# EasyEDA schematic Buttons-Sch-EasyEDA.json
TITLE: WatchLink Buttons Sensor; REV: 1.3; Date: 2024-01-16; Sheet: 1/1; Drawn By: Anandghan W; Company: UW Ubicomp Lab
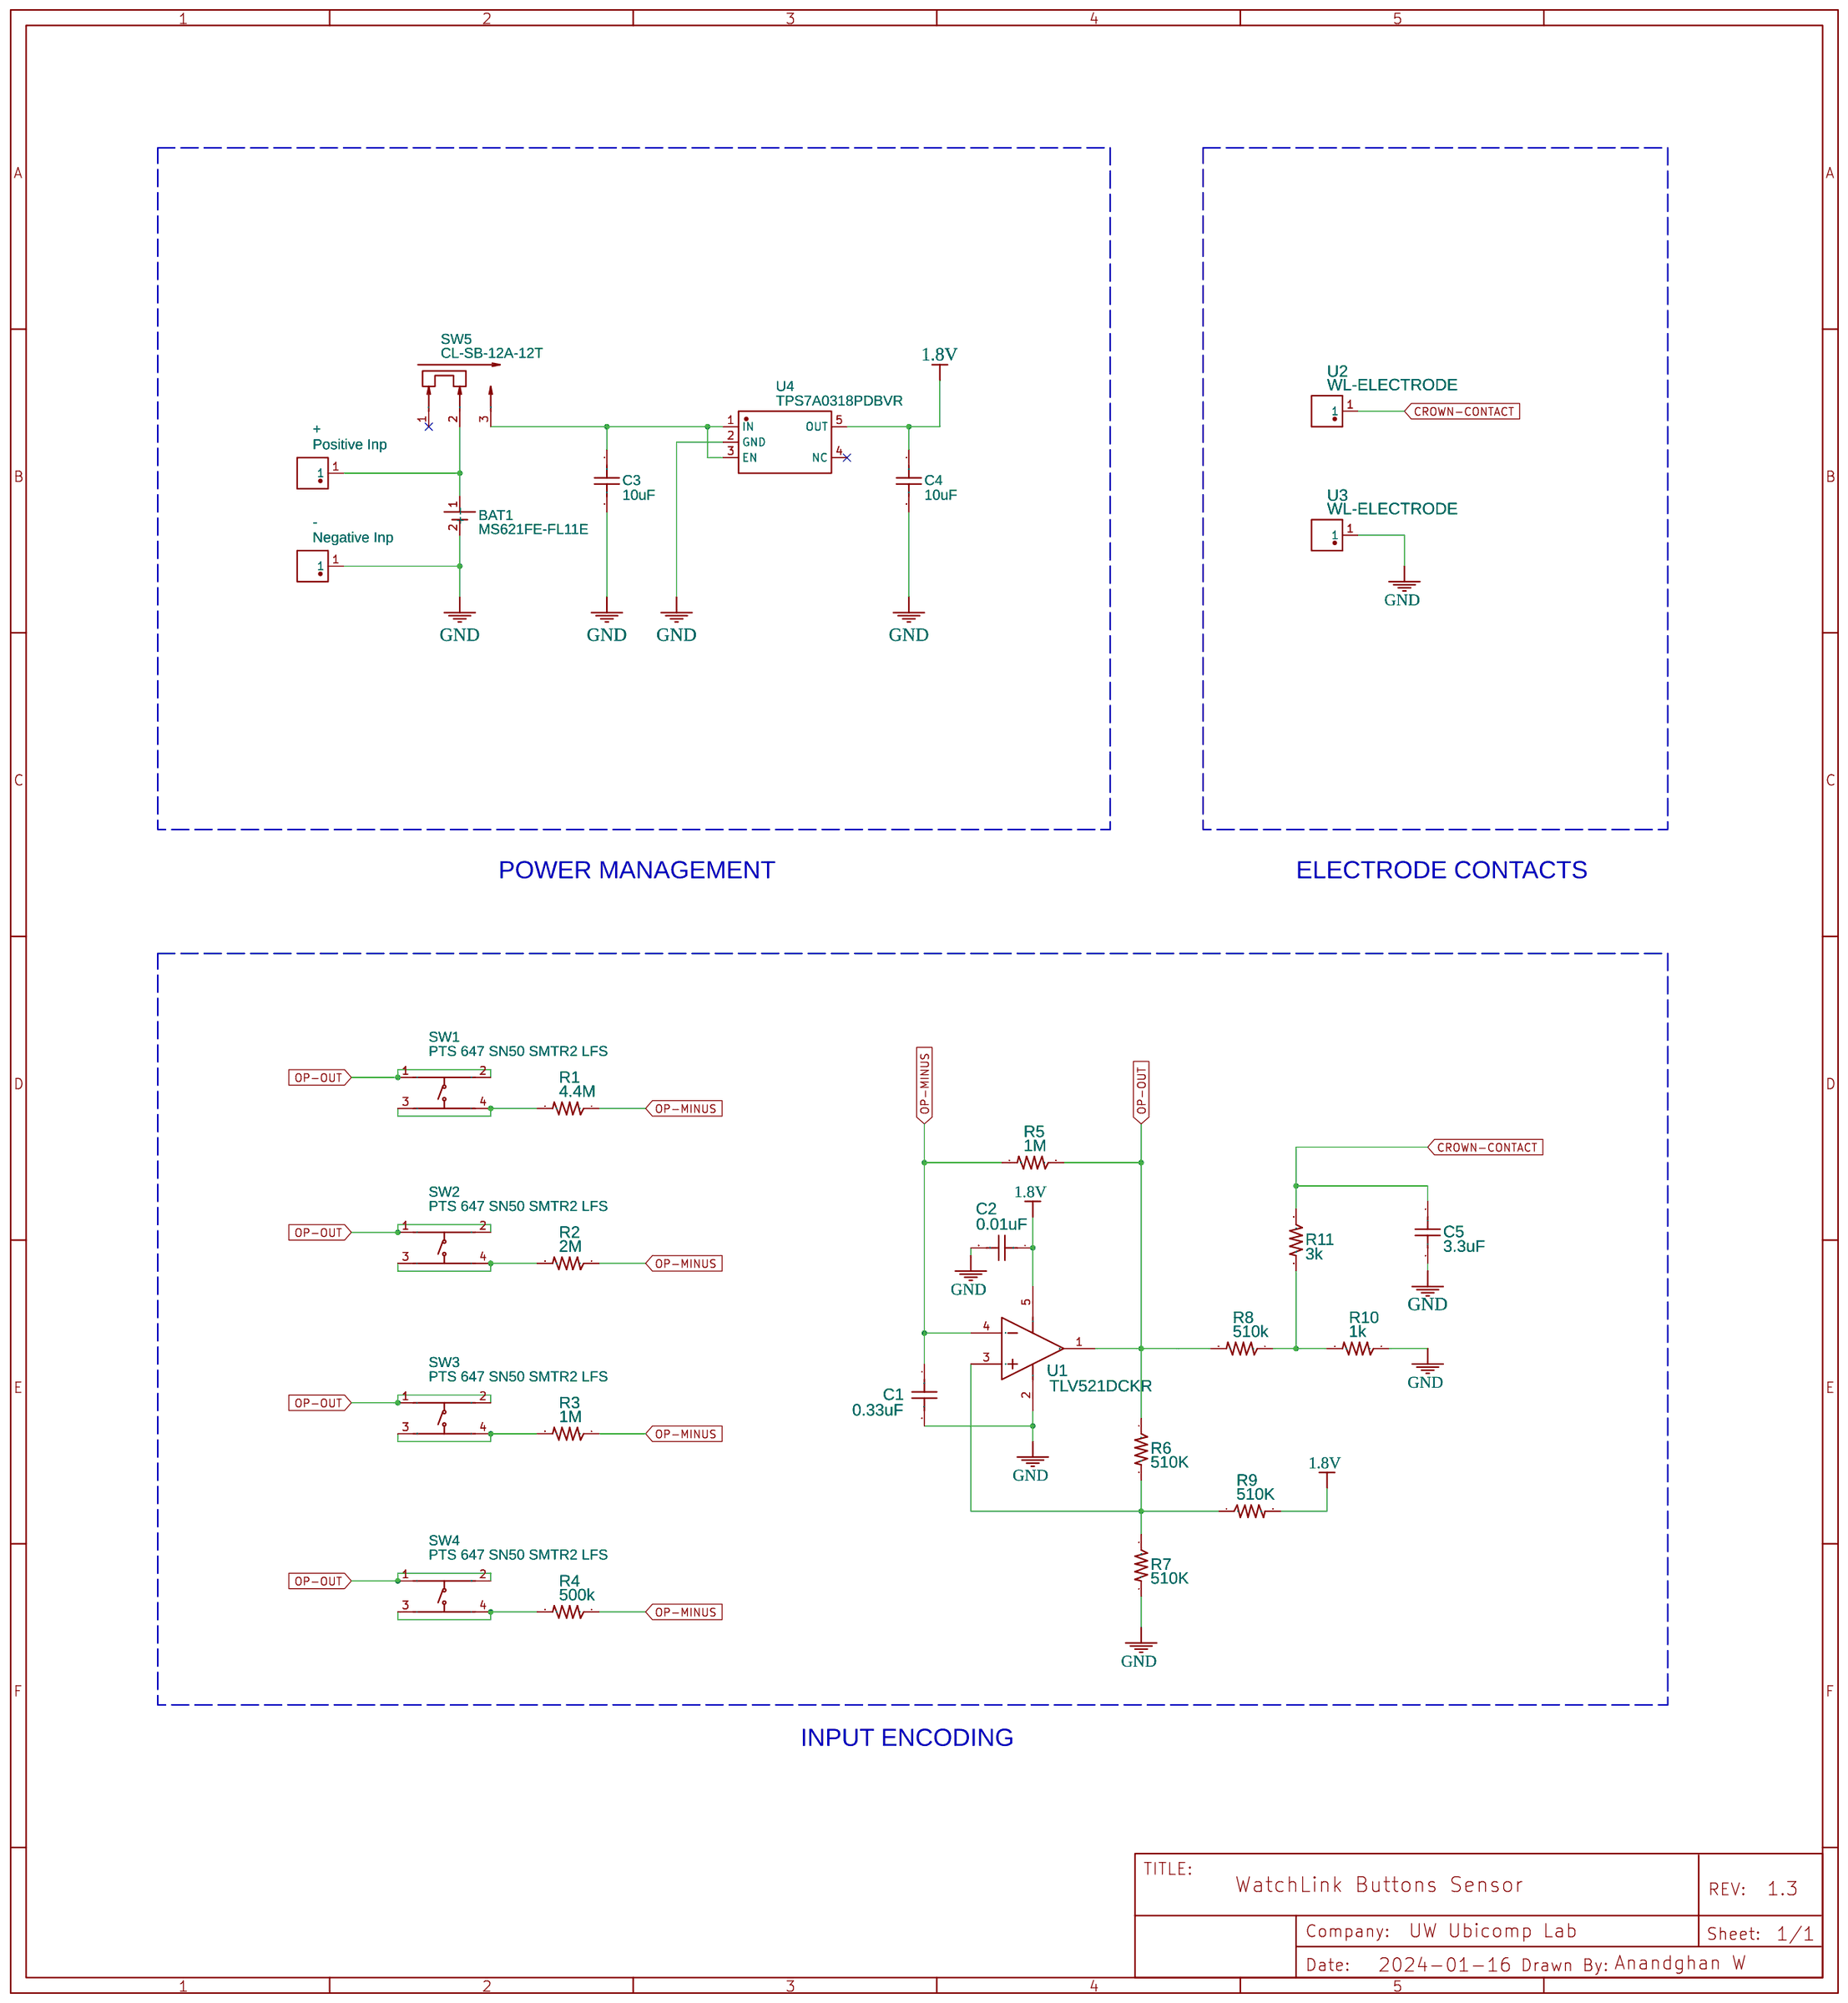
[diagram p0: schematic sheet]

## Parts
+  Positive Inp  [WL-ELECTRODE]
-  Negative Inp  [WL-ELECTRODE]
BAT1  MS621FE-FL11E  [MS621FE-FL11E]
C1  0.33uF  [C0402]
C2  0.01uF  [C0402]
C3  10uF  [C0603]
C4  10uF  [C0603]
C5  3.3uF  [C0402]
R1  4.4M  [R0402]
R2  2M  [R0402]
R3  1M  [R0402]
R4  500k  [R0402]
R5  1M  [R0402]
R6  510K  [R0402]
R7  510K  [R0402]
R8  510k  [R0402]
R9  510K  [R0402]
R10  1k  [R0402]
R11  3k  [R0402]
SW1  PTS 647 SN50 SMTR2 LFS  [KEY-SMD_4P-L4.5-W4.5-P3.00-LS6.5-TL]
SW2  PTS 647 SN50 SMTR2 LFS  [KEY-SMD_4P-L4.5-W4.5-P3.00-LS6.5-TL]
SW3  PTS 647 SN50 SMTR2 LFS  [KEY-SMD_4P-L4.5-W4.5-P3.00-LS6.5-TL]
SW4  PTS 647 SN50 SMTR2 LFS  [KEY-SMD_4P-L4.5-W4.5-P3.00-LS6.5-TL]
SW5  CL-SB-12A-12T  [SW-SMD_NIDEC_CL-SB-12A-12T]
U1  TLV521DCKR  [SC-70-5_L2.1-W1.3-P0.65-LS2.1-BR]
U2  WL-ELECTRODE  [WL-PIXEL-ELECTRODE]
U3  WL-ELECTRODE  [WL-PIXEL-ELECTRODE]
U4  TPS7A0318PDBVR  [SOT-23-5_L2.9-W1.6-P0.95-LS2.8-BR]

## Library data of the parts
+ - U2 U3 = WL-ELECTRODE: Supplier: LCSC; Supplier Part: C9900001249; Manufacturer: null; Manufacturer Part: POGO pin探针; JLCPCB Part Class: Extended Part; Contributor: rckr
BAT1 = ML614 / ML621 - COIN CELL: Manufacturer: Panasonic; Manufacturer Part: ML621 / ML614; Supplier Part: undefined; link: https://industrial.panasonic.com/ww/products/batteries/primary-batteries/lithium-batteries/coin-type-rechargeable-lithium-batteries-ml-series/ML621; Contributor: ThijsH
C1-C5 = CC0402JRX7R8BB473: Supplier: LCSC; Supplier Part: C5185458; Manufacturer: YAGEO(国巨); Capacitance: 47nF; Contributor: rckr
R1-R11 = R-US_R0402: RESISTOR, American symbol; Contributor: Adafruit
SW1-SW4 = PTS 647 SN50 SMTR2 LFS: Contributor: LCSC; Supplier: LCSC; Supplier Part: C2799414; Manufacturer: C&K; Manufacturer Part: PTS647SN50SMTR2LFS; JLCPCB Part Class: Extended Part
SW5 = CL-SB-12A-12T: Contributor: LCSC; Supplier: LCSC; Supplier Part: C2921646; Manufacturer: NIDEC(尼得科); JLCPCB Part Class: Extended Part
U1 = TLV521DCKR: Contributor: LCSC; Supplier: LCSC; Supplier Part: C655085; Manufacturer: TI(德州仪器); JLCPCB Part Class: Extended Part
U4 = TPS7A0318PDBVR: Contributor: lcsc; Supplier: LCSC; Supplier Part: C3747103; Manufacturer: TI(德州仪器); JLCPCB Part Class: Extended Part

## Nets
1.8V: C2.1 C4.1 R9.2 U1.5(V+) U4.5(OUT)
GND: -.1 BAT1.2(-) C1.2 C2.2 C3.2 C4.2 C5.2 R7.2 R10.1 U1.2(V-) U3.1 U4.2(GND)
CROWN-CONTACT: C5.1 R11.1 U2.1
OP-MINUS: C1.1 R1.1 R2.1 R3.1 R4.1 R5.2 U1.4(IN-)
OP-OUT: R5.1 R6.1 R8.2 SW1.1 SW1.2 SW2.1 SW2.2 SW3.1 SW3.2 SW4.1 SW4.2 U1.1(OUT)
Net-(+-1): +.1 BAT1.1(+) SW5.2
Net-(C3-1): C3.1 SW5.3 U4.1(IN) U4.3(EN)
Net-(R1-2): R1.2 SW1.3 SW1.4
Net-(R2-2): R2.2 SW2.3 SW2.4
Net-(R3-2): R3.2 SW3.3 SW3.4
Net-(R4-2): R4.2 SW4.3 SW4.4
Net-(R6-2): R6.2 R7.1 R9.1 U1.3(IN+)
Net-(R8-1): R8.1 R10.2 R11.2

Not connected (* = marked no-connect by the designer): SW5 1*; U4 4(NC)*

## Notes on the sheet
- POWER MANAGEMENT
- ELECTRODE CONTACTS
- INPUT ENCODING
